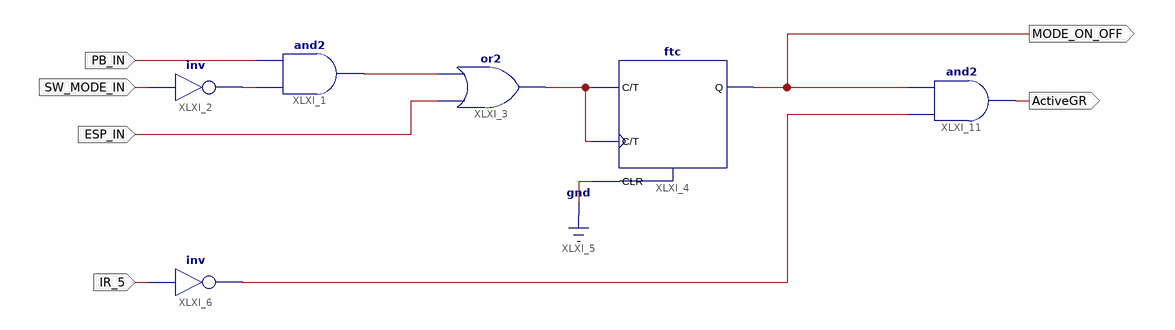
[diagram p0: schematic sheet 1]
// Xilinx ISE schematic Alarm_Garage_V4.sch (spartan6) as structural Verilog: 6 symbols, 6 ports
module Alarm_Garage_V4 (
  input  PB_IN,
  input  SW_MODE_IN,
  input  ESP_IN,
  input  IR_5,
  output MODE_ON_OFF,
  output ActiveGR
);

  wire XLXN_1, XLXN_4, XLXN_6, XLXN_9;

  and XLXI_1 (XLXN_4, XLXN_1, PB_IN);
  not XLXI_2 (XLXN_1, SW_MODE_IN);
  or XLXI_3 (XLXN_6, ESP_IN, XLXN_4);
  ftc XLXI_4 (.C(XLXN_6), .CLR(1'b0), .T(XLXN_6), .Q(MODE_ON_OFF));
  not XLXI_6 (XLXN_9, IR_5);
  and XLXI_11 (ActiveGR, XLXN_9, MODE_ON_OFF);
endmodule
